# Altium project PCB_Project.PrjPcb
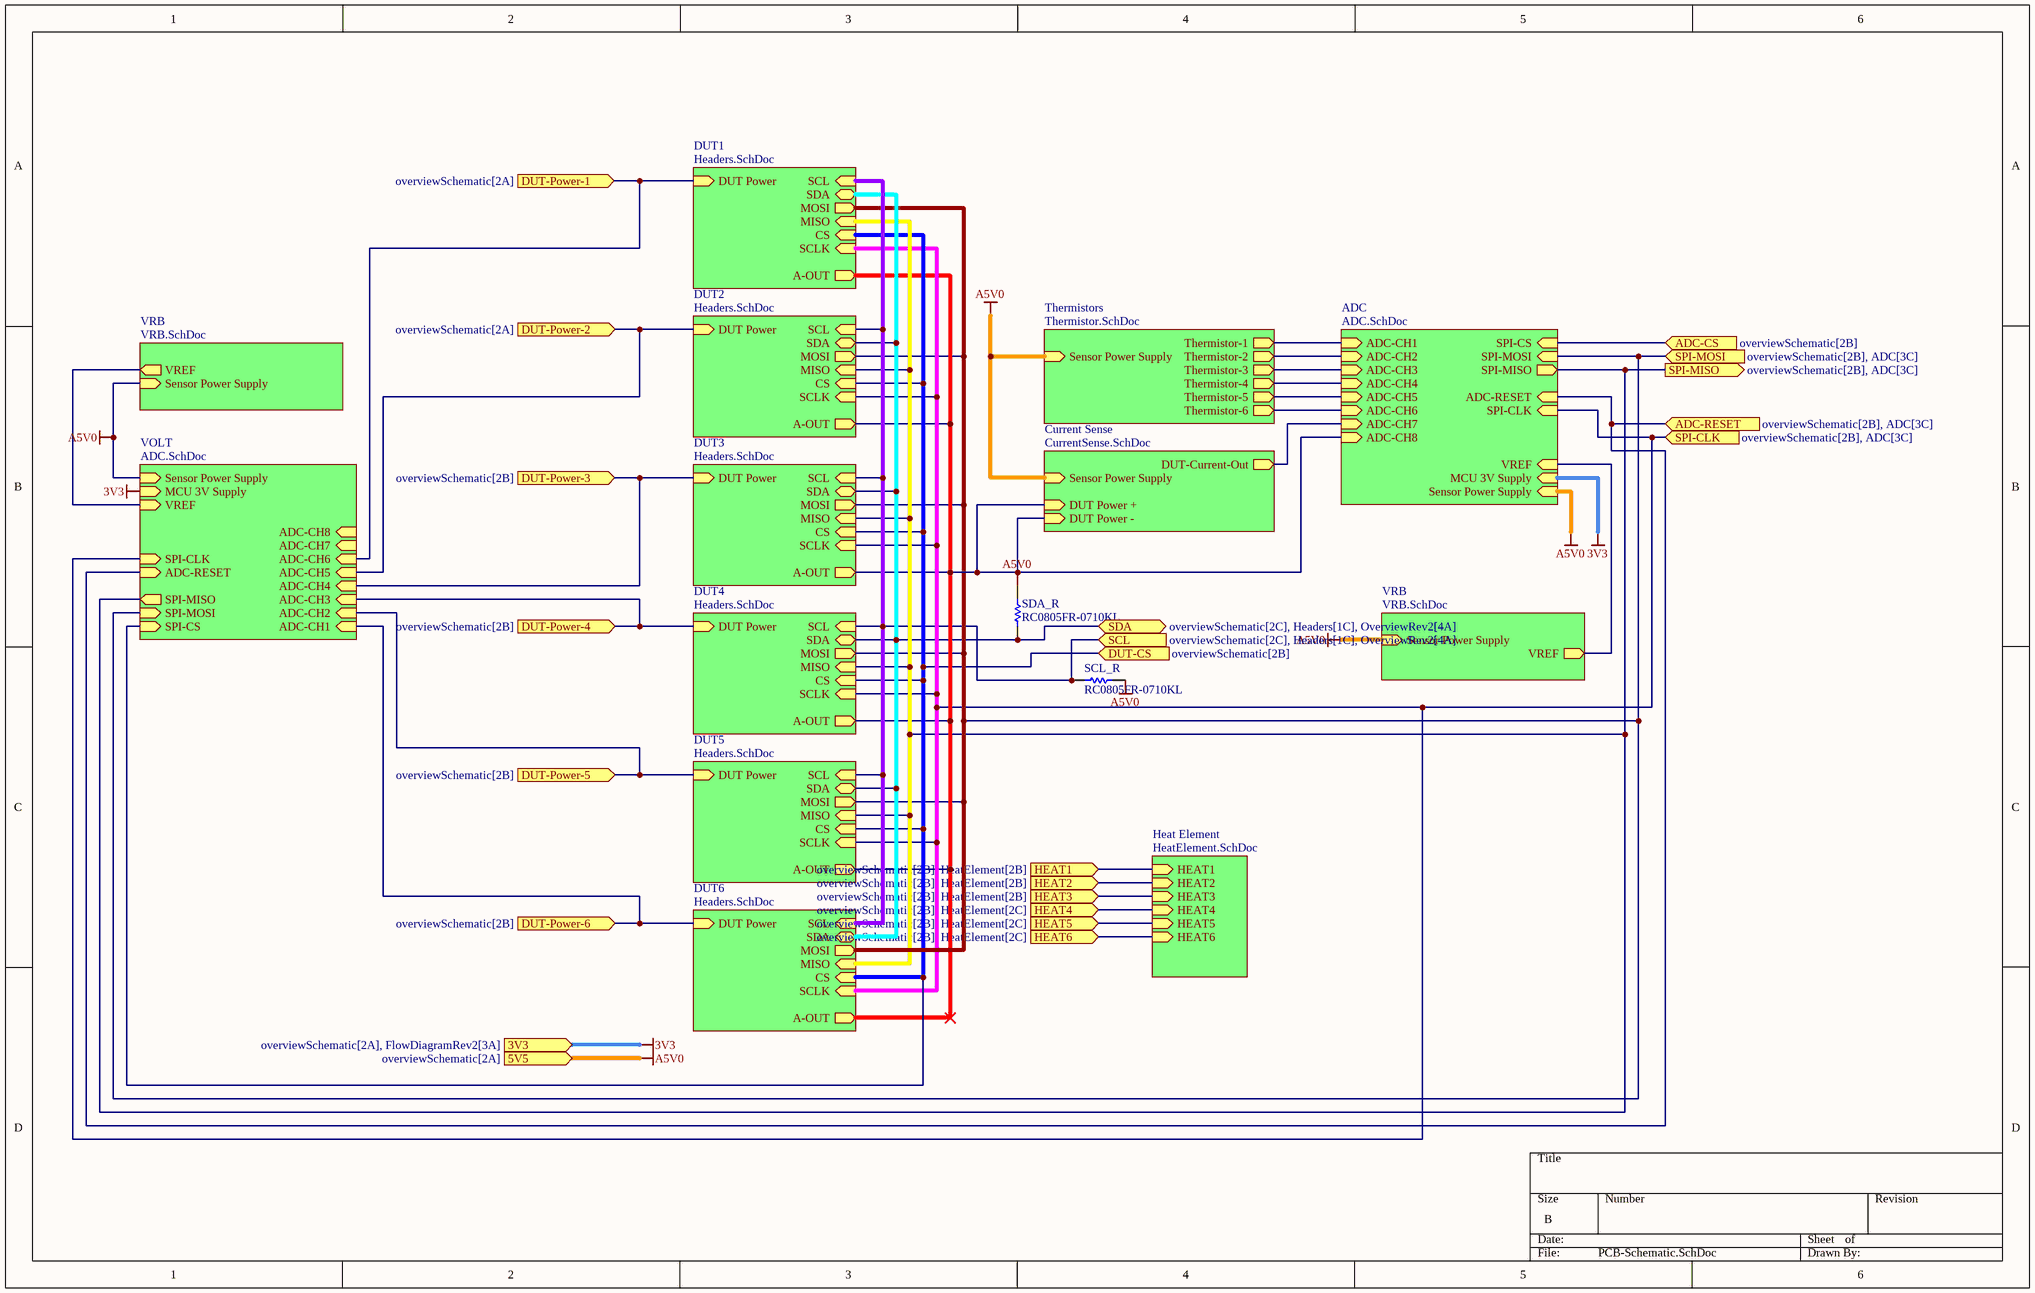
[diagram p0: PCB-Schematic.SchDoc]
7 sheets, 51 parts. Net scope: hierarchical (ports join the sheet entries above them; power ports are global).
Board file: PCB1.PcbDoc
Sheets:
  PCB-Schematic.SchDoc
    ADC = ADC.SchDoc
    VRB = VRB.SchDoc
    Current Sense = CurrentSense.SchDoc
    Heat Element = HeatElement.SchDoc
    Thermistors = Thermistor.SchDoc
    DUT1 = Headers.SchDoc
    DUT2 = Headers.SchDoc
    DUT3 = Headers.SchDoc
    DUT4 = Headers.SchDoc
    DUT5 = Headers.SchDoc
    DUT6 = Headers.SchDoc
    VOLT = ADC.SchDoc
    VRB = VRB.SchDoc

## Sheet PCB-Schematic.SchDoc
size B; SheetNumber: 2; SheetTotal: 14

### Parts
SCL_R  RC0805FR-0710KL  [RESC2013X60X35NL10T20]
SDA_R  RC0805FR-0710KL  [RESC2013X60X35NL10T20]

### Sub-sheets
ADC = ADC.SchDoc: ADC-CH1 (in), ADC-CH2 (in), ADC-CH3 (in), ADC-CH4 (in), ADC-CH5 (in), ADC-CH6 (in), SPI-CLK (in), SPI-MOSI (in), SPI-MISO (out), SPI-CS (in), ADC-RESET (in), ADC-CH7 (in), Sensor Power Supply (in), MCU 3V Supply (in), VREF (in), ADC-CH8 (in)
Current Sense = CurrentSense.SchDoc: DUT Power + (in), DUT Power - (in), DUT-Current-Out (out), Sensor Power Supply (in)
DUT1 = Headers.SchDoc: SCL (in), SDA (bidir), CS (in), SCLK (in), A-OUT (out), DUT Power (in), MOSI (out), MISO (in)
DUT2 = Headers.SchDoc: SCL (in), SDA (bidir), CS (in), SCLK (in), A-OUT (out), DUT Power (in), MOSI (out), MISO (in)
DUT3 = Headers.SchDoc: SCL (in), SDA (bidir), CS (in), SCLK (in), A-OUT (out), DUT Power (in), MOSI (out), MISO (in)
DUT4 = Headers.SchDoc: SCL (in), SDA (bidir), CS (in), SCLK (in), A-OUT (out), DUT Power (in), MOSI (out), MISO (in)
DUT5 = Headers.SchDoc: SCL (in), SDA (bidir), CS (in), SCLK (in), A-OUT (out), DUT Power (in), MOSI (out), MISO (in)
DUT6 = Headers.SchDoc: SCL (in), SDA (bidir), CS (in), SCLK (in), A-OUT (out), DUT Power (in), MOSI (out), MISO (in)
Heat Element = HeatElement.SchDoc: HEAT1 (in), HEAT2 (in), HEAT3 (in), HEAT4 (in), HEAT5 (in), HEAT6 (in)
Thermistors = Thermistor.SchDoc: Thermistor-6 (out), Thermistor-5 (out), Thermistor-1 (out), Thermistor-2 (out), Thermistor-3 (out), Thermistor-4 (out), Sensor Power Supply (in)
VOLT = ADC.SchDoc: ADC-CH1 (in), ADC-CH2 (in), ADC-CH3 (in), ADC-CH4 (in), ADC-CH5 (in), ADC-CH6 (in), SPI-CLK (in), SPI-MOSI (in), SPI-MISO (out), SPI-CS (in), ADC-RESET (in), ADC-CH7 (in), Sensor Power Supply (in), MCU 3V Supply (in), VREF (in), ADC-CH8 (in)
VRB = VRB.SchDoc: Sensor Power Supply (in), VREF (out)
VRB = VRB.SchDoc: Sensor Power Supply (in), VREF (out)

### Ports
3V3 (in, see overviewSchematic[2A], FlowDiagramRev2[3A]), 5V5 (in, see overviewSchematic[2A]), ADC-CS (in, see overviewSchematic[2B]), ADC-RESET (in, see overviewSchematic[2B], ADC[3C]), DUT-CS (in, see overviewSchematic[2B]), DUT-Power-1 (in, see overviewSchematic[2A]), DUT-Power-2 (in, see overviewSchematic[2A]), DUT-Power-3 (in, see overviewSchematic[2B]), DUT-Power-4 (in, see overviewSchematic[2B]), DUT-Power-5 (in, see overviewSchematic[2B]), DUT-Power-6 (in, see overviewSchematic[2B]), HEAT1 (in, see overviewSchematic[2B], HeatElement[2B]), HEAT2 (in, see overviewSchematic[2B], HeatElement[2B]), HEAT3 (in, see overviewSchematic[2B], HeatElement[2B]), HEAT4 (in, see overviewSchematic[2B], HeatElement[2C]), HEAT5 (in, see overviewSchematic[2B], HeatElement[2C]), HEAT6 (in, see overviewSchematic[2B], HeatElement[2C]), SCL (in, see overviewSchematic[2C], Headers[1C], OverviewRev2[4A]), SDA (bidir, see overviewSchematic[2C], Headers[1C], OverviewRev2[4A]), SPI-CLK (in, see overviewSchematic[2B], ADC[3C]), SPI-MISO (out, see overviewSchematic[2B], ADC[3C]), SPI-MOSI (in, see overviewSchematic[2B], ADC[3C])

### Nets
3V3: port 3V3, sheet ADC/MCU 3V Supply, sheet VOLT/MCU 3V Supply
A5V0: SCL_R.2 SDA_R.2 ; port DUT-Power-1, port DUT-Power-2, port DUT-Power-3, port DUT-Power-4, port DUT-Power-5, port DUT-Power-6, port 5V5, sheet ADC/Sensor Power Supply, sheet VRB/Sensor Power Supply, sheet Current Sense/Sensor Power Supply, sheet Thermistors/Sensor Power Supply, sheet DUT1/DUT Power, sheet DUT2/DUT Power, sheet DUT3/DUT Power, sheet DUT4/DUT Power, sheet DUT5/DUT Power, sheet DUT6/DUT Power, sheet VOLT/ADC-CH1, sheet VOLT/ADC-CH2, sheet VOLT/ADC-CH3, sheet VOLT/ADC-CH4, sheet VOLT/ADC-CH5, sheet VOLT/ADC-CH6, sheet VOLT/Sensor Power Supply, sheet VRB/Sensor Power Supply
NetTHERM1_2: sheet ADC/ADC-CH6, sheet Thermistors/Thermistor-6
NetTHERM2_2: sheet ADC/ADC-CH5, sheet Thermistors/Thermistor-5
NetTHERM4_2: sheet ADC/ADC-CH3, sheet Thermistors/Thermistor-3
NetTHERM5_2: sheet ADC/ADC-CH2, sheet Thermistors/Thermistor-2
NetTHERM6_2: sheet ADC/ADC-CH1, sheet Thermistors/Thermistor-1
NetADC_1: sheet ADC/ADC-CH7, sheet Current Sense/DUT-Current-Out
NetADC_2: sheet ADC/ADC-CH8, sheet Current Sense/DUT Power +, sheet Current Sense/DUT Power -, sheet DUT1/A-OUT, sheet DUT2/A-OUT, sheet DUT3/A-OUT, sheet DUT4/A-OUT, sheet DUT5/A-OUT, sheet DUT6/A-OUT
NetADC_6: sheet ADC/VREF, sheet VRB/VREF
NetADC_10: sheet ADC/ADC-CH4, sheet Thermistors/Thermistor-4
NetADC_19: port ADC-RESET, sheet ADC/ADC-RESET, sheet VOLT/ADC-RESET
NetADC_20: port SPI-CLK, sheet ADC/SPI-CLK, sheet DUT1/SCLK, sheet DUT2/SCLK, sheet DUT3/SCLK, sheet DUT4/SCLK, sheet DUT5/SCLK, sheet DUT6/SCLK, sheet VOLT/SPI-CLK
NetADC_21: port ADC-CS, sheet ADC/SPI-CS
NetADC_23: port SPI-MISO, sheet ADC/SPI-MISO, sheet DUT1/MISO, sheet DUT2/MISO, sheet DUT3/MISO, sheet DUT4/MISO, sheet DUT5/MISO, sheet DUT6/MISO, sheet VOLT/SPI-MISO
NetADC_24: port SPI-MOSI, sheet ADC/SPI-MOSI, sheet DUT1/MOSI, sheet DUT2/MOSI, sheet DUT3/MOSI, sheet DUT4/MOSI, sheet DUT5/MOSI, sheet DUT6/MOSI, sheet VOLT/SPI-MOSI
NetADC_VOLT_6: sheet VOLT/VREF, sheet VRB/VREF
NetADC_VOLT_21: port DUT-CS, sheet DUT1/CS, sheet DUT2/CS, sheet DUT3/CS, sheet DUT4/CS, sheet DUT5/CS, sheet DUT6/CS, sheet VOLT/SPI-CS
NetHEAT1_1: port HEAT1, sheet Heat Element/HEAT1
NetHEAT2_1: port HEAT2, sheet Heat Element/HEAT2
NetHEAT3_1: port HEAT3, sheet Heat Element/HEAT3
NetHEAT4_1: port HEAT4, sheet Heat Element/HEAT4
NetHEAT5_1: port HEAT5, sheet Heat Element/HEAT5
NetHEAT6_1: port HEAT6, sheet Heat Element/HEAT6
NetL_DUT1_1: SCL_R.1 ; port SCL, sheet DUT1/SCL, sheet DUT2/SCL, sheet DUT3/SCL, sheet DUT4/SCL, sheet DUT5/SCL, sheet DUT6/SCL
NetL_DUT1_2: SDA_R.1 ; port SDA, sheet DUT1/SDA, sheet DUT2/SDA, sheet DUT3/SDA, sheet DUT4/SDA, sheet DUT5/SDA, sheet DUT6/SDA

### Library data of the parts
SCL_R SDA_R = RESIST 0805: Chip Resistor, 10 KOhm, +/- 1%, 0.125 W, -55 to 155 degC, 0805 (2012 Metric), RoHS, Tape and Reel; Manufacturer: Yageo; Voltage Rating: 150 V; Mount: Surface Mount; ComponentLink1Description: Manufacturer URL; ComponentLink2URL: http://www.yageo.com/documents/recent/PYu-RC_Group_51_RoHS_L_04.pdf; Pins: 2; Length: 2 mm; Min Operating Temperature: -55 degC; Height: 0.5 mm; Mounting Technology: Surface Mount; RoHSCompliant: true; REACH SVHC: No SVHC; ComponentLink1URL: http://www.yageo.com/; Max Operating Temperature: 155 degC; PackageReference: 0805; DatasheetVersion: Rev. 4, 02/2016; Package Quantity: 5000; Packaging: Tape and Reel; ComponentLink2Description: Datasheet; PackageDescription: 2-Pin Surface Mounted Device, Body 2 x 1.25 mm

## Sheet ADC.SchDoc
size A; SheetNumber: 5; SheetTotal: 14
Used 2 times, as channels ADC, VOLT. Parts and nets are listed once, with the designators drawn on the sheet.
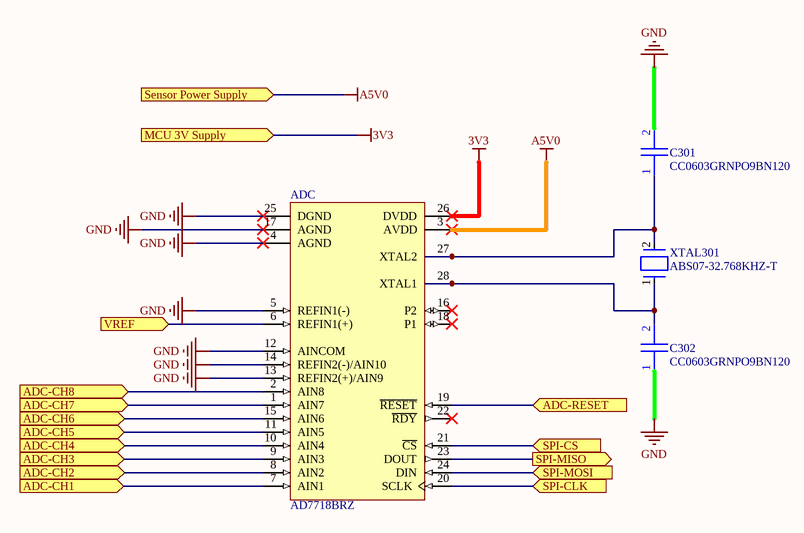
[diagram p1: ADC.SchDoc]

### Parts
ADC  AD7718BRZ  [RW-28_L]
C301  CC0603GRNPO9BN120  [CC0603GRNPO9BN120]
C302  CC0603GRNPO9BN120  [CC0603GRNPO9BN120]
XTAL301  ABS07-32.768KHZ-T  [FP-ABS07-MFG]

### Ports
ADC-CH1 (in, see PCB-Schematic[3A]), ADC-CH2 (in, see PCB-Schematic[3A]), ADC-CH3 (in, see PCB-Schematic[3B]), ADC-CH4 (in, see PCB-Schematic[3B]), ADC-CH5 (in, see PCB-Schematic[3B]), ADC-CH6 (in, see PCB-Schematic[3B]), ADC-CH7 (in, see PCB-Schematic[3B]), ADC-CH8 (in, see PCB-Schematic[3B]), ADC-RESET (in, see PCB-Schematic[4B]), MCU 3V Supply (in, see PCB-Schematic[4B]), Sensor Power Supply (in, see PCB-Schematic[4B], CurrentSense[2B], Thermistor[1A], VRB[2B]), SPI-CLK (in, see PCB-Schematic[4B]), SPI-CS (in, see PCB-Schematic[4A]), SPI-MISO (out, see PCB-Schematic[4B]), SPI-MOSI (in, see PCB-Schematic[4A]), VREF (in, see PCB-Schematic[4B], VRB[4C])

### Nets
3V3: ADC.26(DVDD) ; port MCU 3V Supply
A5V0: ADC.3(AVDD) ; port Sensor Power Supply
GND: ADC.4(AGND) ADC.5(REFIN1(-)) ADC.12(AINCOM) ADC.13(REFIN2(+)/AIN9) ADC.14(REFIN2(-)/AIN10) ADC.17(AGND) ADC.25(DGND) C301.2 C302.1
ADC-CH1: ADC.7(AIN1) ; port ADC-CH1
ADC-CH2: ADC.8(AIN2) ; port ADC-CH2
ADC-CH3: ADC.9(AIN3) ; port ADC-CH3
ADC-CH4: ADC.10(AIN4) ; port ADC-CH4
ADC-CH5: ADC.11(AIN5) ; port ADC-CH5
ADC-CH6: ADC.15(AIN6) ; port ADC-CH6
ADC-CH7: ADC.1(AIN7) ; port ADC-CH7
ADC-CH8: ADC.2(AIN8) ; port ADC-CH8
ADC-RESET: ADC.19(~{RESET}) ; port ADC-RESET
SPI-CLK: ADC.20(SCLK) ; port SPI-CLK
SPI-CS: ADC.21(~{CS}) ; port SPI-CS
SPI-MISO: ADC.23(DOUT) ; port SPI-MISO
SPI-MOSI: ADC.24(DIN) ; port SPI-MOSI
VREF: ADC.6(REFIN1(+)) ; port VREF
NetADC_27: ADC.27(XTAL2) C301.1 XTAL301.2
NetADC_28: ADC.28(XTAL1) C302.2 XTAL301.1

Not connected (* = marked no-connect by the designer): ADC 16(P2)* 18(P1)* 22(~{RDY})*

### Channels
ADC: designators ADC=ADC C301=C1 C302=C2 XTAL301=XTAL1; ports ADC-CH1=NetTHERM6_2 ADC-CH2=NetTHERM5_2 ADC-CH3=NetTHERM4_2 ADC-CH4=NetADC_10 ADC-CH5=NetTHERM2_2 ADC-CH6=NetTHERM1_2 ADC-CH7=NetADC_1 ADC-CH8=NetADC_2 ADC-RESET=NetADC_19 MCU 3V Supply=3V3 Sensor Power Supply=A5V0 SPI-CLK=NetADC_20 SPI-CS=NetADC_21 SPI-MISO=NetADC_23 SPI-MOSI=NetADC_24 VREF=NetADC_6
VOLT: designators end in _VOLT; ports ADC-CH1=A5V0 ADC-CH2=A5V0 ADC-CH3=A5V0 ADC-CH4=A5V0 ADC-CH5=A5V0 ADC-CH6=A5V0 ADC-CH7=NetADC_VOLT_1 ADC-CH8=NetADC_VOLT_2 ADC-RESET=NetADC_19 MCU 3V Supply=3V3 Sensor Power Supply=A5V0 SPI-CLK=NetADC_20 SPI-CS=NetADC_VOLT_21 SPI-MISO=NetADC_23 SPI-MOSI=NetADC_24 VREF=NetADC_VOLT_6

### Library data of the parts
ADC = CMP-0313-01290-2: 10 Channel 24-Bit Low Power Sigma-Delta Analog-to-Digital Converter with Serial, SPI Interface, 1.365KSPS, -40 to +85 degC, RW-28, Pb-Free, Tube; Generic Part Number: AD7718; Manufacturer: Analog Devices; Channels: 10; Throughput Rate (SPS): 1.365K; Interface: Ser, SPI; Resolution (Bits): 24; ComponentLink1URL: http://www.analog.com/en/index.html; ComponentLink2URL: http://www.analog.com/static/imported-files/data_sheets/AD7708_7718.pdf; Packing: Tube; ComponentLink4URL: http://www.analog.com/en/analog-to-digital-converters/ad-converters/ad7718/products/product.html; PackageDescription: 28-Lead Standard Small Outline Package [SOIC_W]; ComponentLink1Description: Manufacturer URL; ComponentLink2Description: Datasheet; PackageVersion: 060706-A; ComponentLink4Description: Product URL; ComponentLink3Description: Package Specification; ComponentLink3URL: http://www.analog.com/static/imported-files/packages/35833120341221RW_28.pdf; RoHS: Y; DatasheetVersion: Rev.0; PackageReference: RW-28; Mounting Technology: Surface Mount; PartNumber: AD7718BRZ; Code_JEDEC: MS-013-AE
C301 C302 = CC0603GRNPO9BN120: 12pF 50V
XTAL301 = CMP-0447-00001-4: Crystal 32.768kHz ±20ppm (Tol) 12.5pF FUND 70kΩ 2-Pin CSMD T/R; ESR (Equivalent Series Resistance): 70kR; Radiation Hardening: No; Frequency: 32.768kHz; Length: 3.2mm; Max Operating Temperature: 85°C; Number of Pins: 2; Series: ABS07; Min Operating Temperature: -40°C; Frequency Tolerance: 20ppm; Packaging: Tape and Reel; Height: 0.9mm; Width: 1.5mm; Depth: 1.5mm; Load Capacitance: 12.5pF; RoHS Compliant: Yes; Tolerance: 20ppm; Termination: SMD/SMT; Lead Free: Lead Free; Series Resistance: 70kR; REACH SVHC: No SVHC; Case/Package: CSMD; Operating Frequency: 32.768 kHz; Package Quantity: 3000

## Sheet VRB.SchDoc
size A; SheetNumber: 4; SheetTotal: 14
Used 2 times, as channels VRB, VRB. Parts and nets are listed once, with the designators drawn on the sheet.
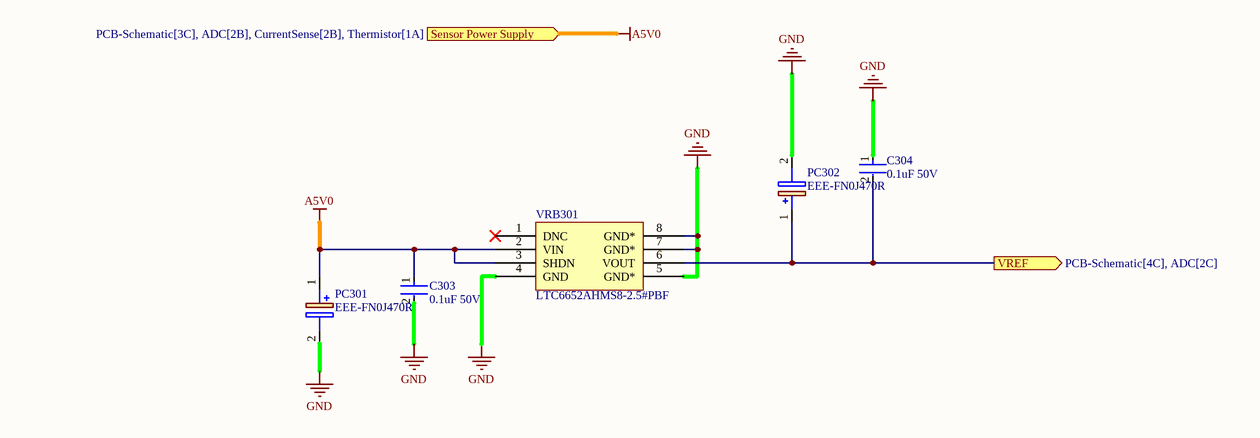
[diagram p2: VRB.SchDoc]

### Parts
C303  0.1uF 50V  [FP-CC0603-DA-MFG]
C304  0.1uF 50V  [FP-CC0603-DA-MFG]
PC301  EEE-FN0J470R  [EEE1AA220WR]
PC302  EEE-FN0J470R  [EEE1AA220WR]
VRB301  LTC6652AHMS8-2.5#PBF  [LTC6652AHMS8-2.5#PBF]

### Ports
Sensor Power Supply (in, see PCB-Schematic[3C], ADC[2B], CurrentSense[2B], Thermistor[1A]), VREF (out, see PCB-Schematic[4C], ADC[2C])

### Nets
A5V0: C303.1 PC301.1(+) VRB301.2(VIN) VRB301.3(SHDN) ; port Sensor Power Supply
GND: C303.2 C304.1 PC301.2(-) PC302.2(-) VRB301.4(GND) VRB301.5(GND*) VRB301.7(GND*) VRB301.8(GND*)
VREF: C304.2 PC302.1(+) VRB301.6(VOUT) ; port VREF

Not connected (* = marked no-connect by the designer): VRB301 1(DNC)*

### Channels
VRB: designators C303=C3 C304=C4 PC301=PC1 PC302=PC2 VRB301=VRB?; ports Sensor Power Supply=A5V0 VREF=NetADC_6
VRB: designators end in _VRB; ports Sensor Power Supply=A5V0 VREF=NetADC_VOLT_6

### Library data of the parts
C303 C304 = CMP-03422-000468-1: CAP CER 0.1UF 50V X7R 0603; Manufacturer: YAGEO; Manufacturer Part Number: CC0603KPX7R9BB104; Temperature Coefficient: 15%; Capacitance: 100 nF; Material: Ceramic; Value: 100 nF; Tolerance: 0.1; Device Class L1: Passive Components; Temperature Range High: +125°C; ComponentLink2Description: Datasheet; Temperature Characteristic: X7R; Octopart: https://octopart.com/cc0603kpx7r9bb104-yageo-12885113; Height: 0.9mm; Mouser Description: Multilayer Ceramic Capacitors MLCC - SMD/SMT 100nF 50V X7R 10%; Device Class L3: Ceramic Capacitors; Voltage Rating: 50 V; Device Class L2: Capacitors; ComponentLink2URL: http://www.yageo.com/documents/recent/UPY-GPHC_X7R_6.3V-to-50V_18.pdf; Package: CC0603-DA; Automotive: No; Voltage: 50 V; RoHS: TRUE; Lead Free: Yes; Digikey Description: CAP CER 0.1UF 50V X7R 0603; Footprint Url: http://www.yageo.com/exep/pages/download/literatures/UPY-C_GEN_24.pdf; Temperature Range Low: -55°C; Temperature: -55°C to +125°C; Category: Cap
PC301 PC302 = EEE-FN0J470R: Capacitor Polarised; Manufacturer_Name: Panasonic; Datasheet Link: http://industrial.panasonic.com/cdbs/www-data/pdf/RDE0000/RDE0000C1259.pdf; Height: 5.5mm; Manufacturer_Part_Number: EEE-FN0J470R; Mouser Part Number: 667-EEE-FN0J470R; Mouser Price/Stock: https://www.mouser.co.uk/ProductDetail/Panasonic/EEE-FN0J470R?qs=OlC7AqGiEDnsjVsw6O9Inw%3D%3D; Arrow Part Number: EEE-FN0J470R; Arrow Price/Stock: https://www.arrow.com/en/products/eee-fn0j470r/panasonic

## Sheet CurrentSense.SchDoc
size A; SheetNumber: 6; SheetTotal: 14
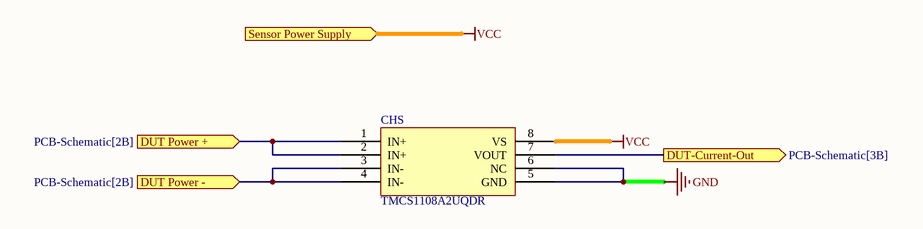
[diagram p3: CurrentSense.SchDoc]

### Parts
CHS  TMCS1108A2UQDR  [TMCS1108]

### Ports
DUT Power + (in, see PCB-Schematic[2B]), DUT Power - (in, see PCB-Schematic[2B]), DUT-Current-Out (out, see PCB-Schematic[3B]), Sensor Power Supply (in, see PCB-Schematic[2B], ADC[2B], Thermistor[1A], VRB[2B])

### Nets
GND: CHS.5(GND) CHS.6(NC)
VCC: CHS.8(VS) ; port Sensor Power Supply  [project net A5V0]
NetADC_1: CHS.7(VOUT) ; port DUT-Current-Out
NetADC_2: CHS.1(IN+) CHS.2(IN+) CHS.3(IN-) CHS.4(IN-) ; port DUT Power +, port DUT Power -

## Sheet HeatElement.SchDoc
size A; SheetNumber: 8; SheetTotal: 14
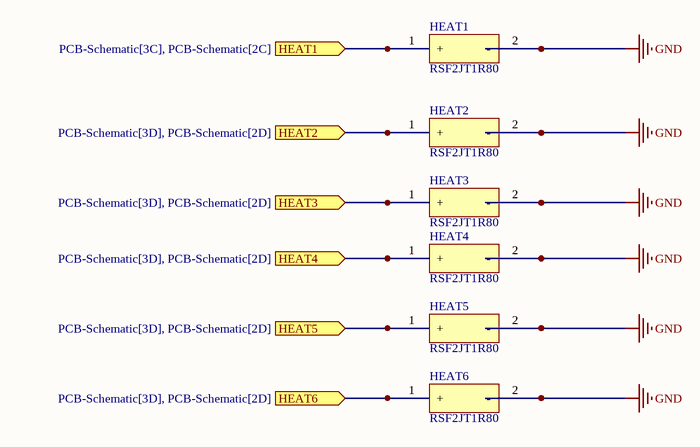
[diagram p4: HeatElement.SchDoc]

### Parts
HEAT1  RSF2JT1R80  [PCBComponent_1]
HEAT2  RSF2JT1R80  [PCBComponent_1]
HEAT3  RSF2JT1R80  [PCBComponent_1]
HEAT4  RSF2JT1R80  [PCBComponent_1]
HEAT5  RSF2JT1R80  [PCBComponent_1]
HEAT6  RSF2JT1R80  [PCBComponent_1]

### Ports
HEAT1 (in, see PCB-Schematic[3C], PCB-Schematic[2C]), HEAT2 (in, see PCB-Schematic[3D], PCB-Schematic[2D]), HEAT3 (in, see PCB-Schematic[3D], PCB-Schematic[2D]), HEAT4 (in, see PCB-Schematic[3D], PCB-Schematic[2D]), HEAT5 (in, see PCB-Schematic[3D], PCB-Schematic[2D]), HEAT6 (in, see PCB-Schematic[3D], PCB-Schematic[2D])

### Nets
GND: HEAT1.2(-) HEAT2.2(-) HEAT3.2(-) HEAT4.2(-) HEAT5.2(-) HEAT6.2(-)
NetHEAT1_1: HEAT1.1(+) ; port HEAT1
NetHEAT2_1: HEAT2.1(+) ; port HEAT2
NetHEAT3_1: HEAT3.1(+) ; port HEAT3
NetHEAT4_1: HEAT4.1(+) ; port HEAT4
NetHEAT5_1: HEAT5.1(+) ; port HEAT5
NetHEAT6_1: HEAT6.1(+) ; port HEAT6

### Library data of the parts
HEAT1-HEAT6 = Component_1

## Sheet Thermistor.SchDoc
size A; SheetNumber: 3; SheetTotal: 14
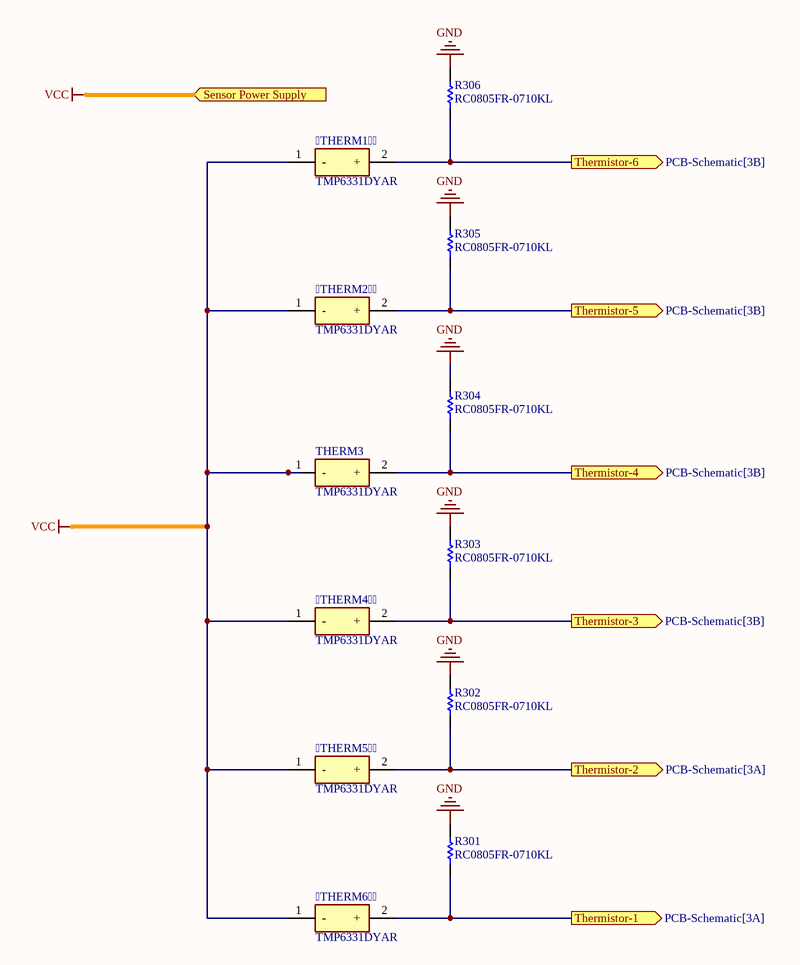
[diagram p5: Thermistor.SchDoc]

### Parts
THERM1  TMP6331DYAR  [TMP6331DYAR]
THERM2  TMP6331DYAR  [TMP6331DYAR]
THERM4  TMP6331DYAR  [TMP6331DYAR]
THERM5  TMP6331DYAR  [TMP6331DYAR]
THERM6  TMP6331DYAR  [TMP6331DYAR]
R301  RC0805FR-0710KL  [RESC2013X60X35NL10T20]
R302  RC0805FR-0710KL  [RESC2013X60X35NL10T20]
R303  RC0805FR-0710KL  [RESC2013X60X35NL10T20]
R304  RC0805FR-0710KL  [RESC2013X60X35NL10T20]
R305  RC0805FR-0710KL  [RESC2013X60X35NL10T20]
R306  RC0805FR-0710KL  [RESC2013X60X35NL10T20]
THERM3  TMP6331DYAR  [TMP6331DYAR]

### Ports
Sensor Power Supply (in, see PCB-Schematic[2A], ADC[2B], CurrentSense[2B], VRB[2B]), Thermistor-1 (out, see PCB-Schematic[3A]), Thermistor-2 (out, see PCB-Schematic[3A]), Thermistor-3 (out, see PCB-Schematic[3B]), Thermistor-4 (out, see PCB-Schematic[3B]), Thermistor-5 (out, see PCB-Schematic[3B]), Thermistor-6 (out, see PCB-Schematic[3B])

### Nets
GND: R301.2 R302.2 R303.2 R304.2 R305.2 R306.2
VCC: THERM1.1(-) THERM2.1(-) THERM4.1(-) THERM5.1(-) THERM6.1(-) THERM3.1(-) ; port Sensor Power Supply  [project net A5V0]
NetTHERM1_2: THERM1.2(+) R306.1 ; port Thermistor-6
NetTHERM2_2: THERM2.2(+) R305.1 ; port Thermistor-5
NetTHERM4_2: THERM4.2(+) R303.1 ; port Thermistor-3
NetTHERM5_2: THERM5.2(+) R302.1 ; port Thermistor-2
NetTHERM6_2: THERM6.2(+) R301.1 ; port Thermistor-1
NetADC_10: R304.1 THERM3.2(+) ; port Thermistor-4

### Library data of the parts
THERM1 THERM2 THERM4 THERM5 THERM6 THERM3 = TMP6331DYAR: PTC Thermistors +/-1% tolerance 100k linear thermistor available in an 0402 package 2-SOT-5X3 -40 to 150; Manufacturer_Name: Texas Instruments; Geometry.Height: 0.77mm; Mouser Part Number: 595-TMP6331DYAR; Mouser Price/Stock: https://www.mouser.co.uk/ProductDetail/Texas-Instruments/TMP6331DYAR?qs=7MVldsJ5UawI0UH0FIHgeA%3D%3D; Manufacturer_Part_Number: TMP6331DYAR; Datasheet Link: https://www.ti.com/lit/ds/symlink/tmp63.pdf?ts=1656390900860&ref_url=https%253A%252F%252Fwww.ti.com%252Fproduct%252FTMP63%252Fpart-details%252FTMP6331DYAR
R301-R306 = RC0805FR-0710KL: Chip Resistor, 10 KOhm, +/- 1%, 0.125 W, -55 to 155 degC, 0805 (2012 Metric), RoHS, Tape and Reel; Manufacturer: Yageo; Voltage Rating: 150 V; Mount: Surface Mount; ComponentLink1Description: Manufacturer URL; ComponentLink2URL: http://www.yageo.com/documents/recent/PYu-RC_Group_51_RoHS_L_04.pdf; Pins: 2; Length: 2 mm; Min Operating Temperature: -55 degC; Height: 0.5 mm; Mounting Technology: Surface Mount; RoHSCompliant: true; REACH SVHC: No SVHC; ComponentLink1URL: http://www.yageo.com/; Max Operating Temperature: 155 degC; PackageReference: 0805; DatasheetVersion: Rev. 4, 02/2016; Package Quantity: 5000; Packaging: Tape and Reel; ComponentLink2Description: Datasheet; PackageDescription: 2-Pin Surface Mounted Device, Body 2 x 1.25 mm

## Sheet Headers.SchDoc
size A; SheetNumber: 7; SheetTotal: 14
Used 6 times, as channels DUT1, DUT2, DUT3, DUT4, DUT5, DUT6. Parts and nets are listed once, with the designators drawn on the sheet.
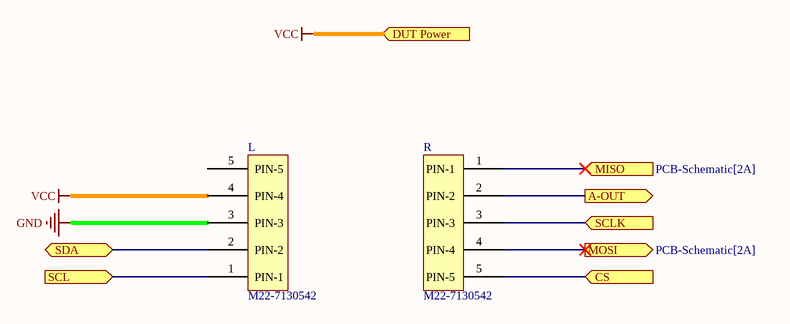
[diagram p6: Headers.SchDoc]

### Parts
L  M22-7130542  [RHDR5W50P0X200_1X5_1050X240X440P]
R  M22-7130542  [RHDR5W50P0X200_1X5_1050X240X440P]

### Ports
A-OUT (out, see PCB-Schematic[2A]), CS (in, see PCB-Schematic[2A]), DUT Power (in, see PCB-Schematic[1A]), MISO (in, see PCB-Schematic[2A]), MOSI (out, see PCB-Schematic[2A]), SCL (in, see PCB-Schematic[2A], OverviewRev2[4A], PCB-Schematic[2C]), SCLK (in, see PCB-Schematic[2A]), SDA (bidir, see PCB-Schematic[2A], OverviewRev2[4A], PCB-Schematic[2C])

### Nets
GND: L.3(PIN-3)
VCC: L.4(PIN-4) ; port DUT Power
A-OUT: R.2(PIN-2) ; port A-OUT
CS: R.5(PIN-5) ; port CS
MISO: R.1(PIN-1) ; port MISO
MOSI: R.4(PIN-4) ; port MOSI
SCL: L.1(PIN-1) ; port SCL
SCLK: R.3(PIN-3) ; port SCLK
SDA: L.2(PIN-2) ; port SDA

Not connected (* = marked no-connect by the designer): L 5(PIN-5)

### Channels
DUT1: designators end in _DUT1; ports A-OUT=NetADC_2 CS=NetADC_VOLT_21 DUT Power=A5V0 MISO=NetADC_23 MOSI=NetADC_24 SCL=NetL_DUT1_1 SCLK=NetADC_20 SDA=NetL_DUT1_2
DUT2: designators end in _DUT2; ports A-OUT=NetADC_2 CS=NetADC_VOLT_21 DUT Power=A5V0 MISO=NetADC_23 MOSI=NetADC_24 SCL=NetL_DUT1_1 SCLK=NetADC_20 SDA=NetL_DUT1_2
DUT3: designators end in _DUT3; ports A-OUT=NetADC_2 CS=NetADC_VOLT_21 DUT Power=A5V0 MISO=NetADC_23 MOSI=NetADC_24 SCL=NetL_DUT1_1 SCLK=NetADC_20 SDA=NetL_DUT1_2
DUT4: designators end in _DUT4; ports A-OUT=NetADC_2 CS=NetADC_VOLT_21 DUT Power=A5V0 MISO=NetADC_23 MOSI=NetADC_24 SCL=NetL_DUT1_1 SCLK=NetADC_20 SDA=NetL_DUT1_2
DUT5: designators end in _DUT5; ports A-OUT=NetADC_2 CS=NetADC_VOLT_21 DUT Power=A5V0 MISO=NetADC_23 MOSI=NetADC_24 SCL=NetL_DUT1_1 SCLK=NetADC_20 SDA=NetL_DUT1_2
DUT6: designators end in _DUT6; ports A-OUT=NetADC_2 CS=NetADC_VOLT_21 DUT Power=A5V0 MISO=NetADC_23 MOSI=NetADC_24 SCL=NetL_DUT1_1 SCLK=NetADC_20 SDA=NetL_DUT1_2

## Nets that join several sheets
3V3: ADC (ADC.26), VOLT (ADC_VOLT.26)
A5V0: PCB-Schematic (SCL_R.2 SDA_R.2), ADC (ADC.3), VRB (C3.1 PC1.1 VRB?.2 VRB?.3), CurrentSense (CHS.8), Thermistor (6 pins), DUT1 (L_DUT1.4), DUT2 (L_DUT2.4), DUT3 (L_DUT3.4), DUT4 (L_DUT4.4), DUT5 (L_DUT5.4), DUT6 (L_DUT6.4), VOLT (7 pins), VRB (C303_VRB.1 PC301_VRB.1 VRB301_VRB.2 VRB301_VRB.3)
GND: ADC (9 pins), VRB (8 pins), CurrentSense (CHS.5 CHS.6), HeatElement (6 pins), Thermistor (6 pins), DUT1 (L_DUT1.3), DUT2 (L_DUT2.3), DUT3 (L_DUT3.3), DUT4 (L_DUT4.3), DUT5 (L_DUT5.3), DUT6 (L_DUT6.3), VOLT (9 pins), VRB (8 pins)
NetTHERM1_2: ADC (ADC.15), Thermistor (THERM1.2 R306.1)
NetTHERM2_2: ADC (ADC.11), Thermistor (THERM2.2 R305.1)
NetTHERM4_2: ADC (ADC.9), Thermistor (THERM4.2 R303.1)
NetTHERM5_2: ADC (ADC.8), Thermistor (THERM5.2 R302.1)
NetTHERM6_2: ADC (ADC.7), Thermistor (THERM6.2 R301.1)
NetADC_1: ADC (ADC.1), CurrentSense (CHS.7)
NetADC_2: ADC (ADC.2), CurrentSense (CHS.1 CHS.2 CHS.3 CHS.4), DUT1 (R_DUT1.2), DUT2 (R_DUT2.2), DUT3 (R_DUT3.2), DUT4 (R_DUT4.2), DUT5 (R_DUT5.2), DUT6 (R_DUT6.2)
NetADC_6: ADC (ADC.6), VRB (C4.2 PC2.1 VRB?.6)
NetADC_10: ADC (ADC.10), Thermistor (R304.1 THERM3.2)
NetADC_19: ADC (ADC.19), VOLT (ADC_VOLT.19)
NetADC_20: ADC (ADC.20), DUT1 (R_DUT1.3), DUT2 (R_DUT2.3), DUT3 (R_DUT3.3), DUT4 (R_DUT4.3), DUT5 (R_DUT5.3), DUT6 (R_DUT6.3), VOLT (ADC_VOLT.20)
NetADC_23: ADC (ADC.23), DUT1 (R_DUT1.1), DUT2 (R_DUT2.1), DUT3 (R_DUT3.1), DUT4 (R_DUT4.1), DUT5 (R_DUT5.1), DUT6 (R_DUT6.1), VOLT (ADC_VOLT.23)
NetADC_24: ADC (ADC.24), DUT1 (R_DUT1.4), DUT2 (R_DUT2.4), DUT3 (R_DUT3.4), DUT4 (R_DUT4.4), DUT5 (R_DUT5.4), DUT6 (R_DUT6.4), VOLT (ADC_VOLT.24)
NetADC_VOLT_6: VOLT (ADC_VOLT.6), VRB (C304_VRB.2 PC302_VRB.1 VRB301_VRB.6)
NetADC_VOLT_21: DUT1 (R_DUT1.5), DUT2 (R_DUT2.5), DUT3 (R_DUT3.5), DUT4 (R_DUT4.5), DUT5 (R_DUT5.5), DUT6 (R_DUT6.5), VOLT (ADC_VOLT.21)
NetL_DUT1_1: PCB-Schematic (SCL_R.1), DUT1 (L_DUT1.1), DUT2 (L_DUT2.1), DUT3 (L_DUT3.1), DUT4 (L_DUT4.1), DUT5 (L_DUT5.1), DUT6 (L_DUT6.1)
NetL_DUT1_2: PCB-Schematic (SDA_R.1), DUT1 (L_DUT1.2), DUT2 (L_DUT2.2), DUT3 (L_DUT3.2), DUT4 (L_DUT4.2), DUT5 (L_DUT5.2), DUT6 (L_DUT6.2)